# EasyEDA Pro project avaruusantenni_tallylight.eprj, board PCB2
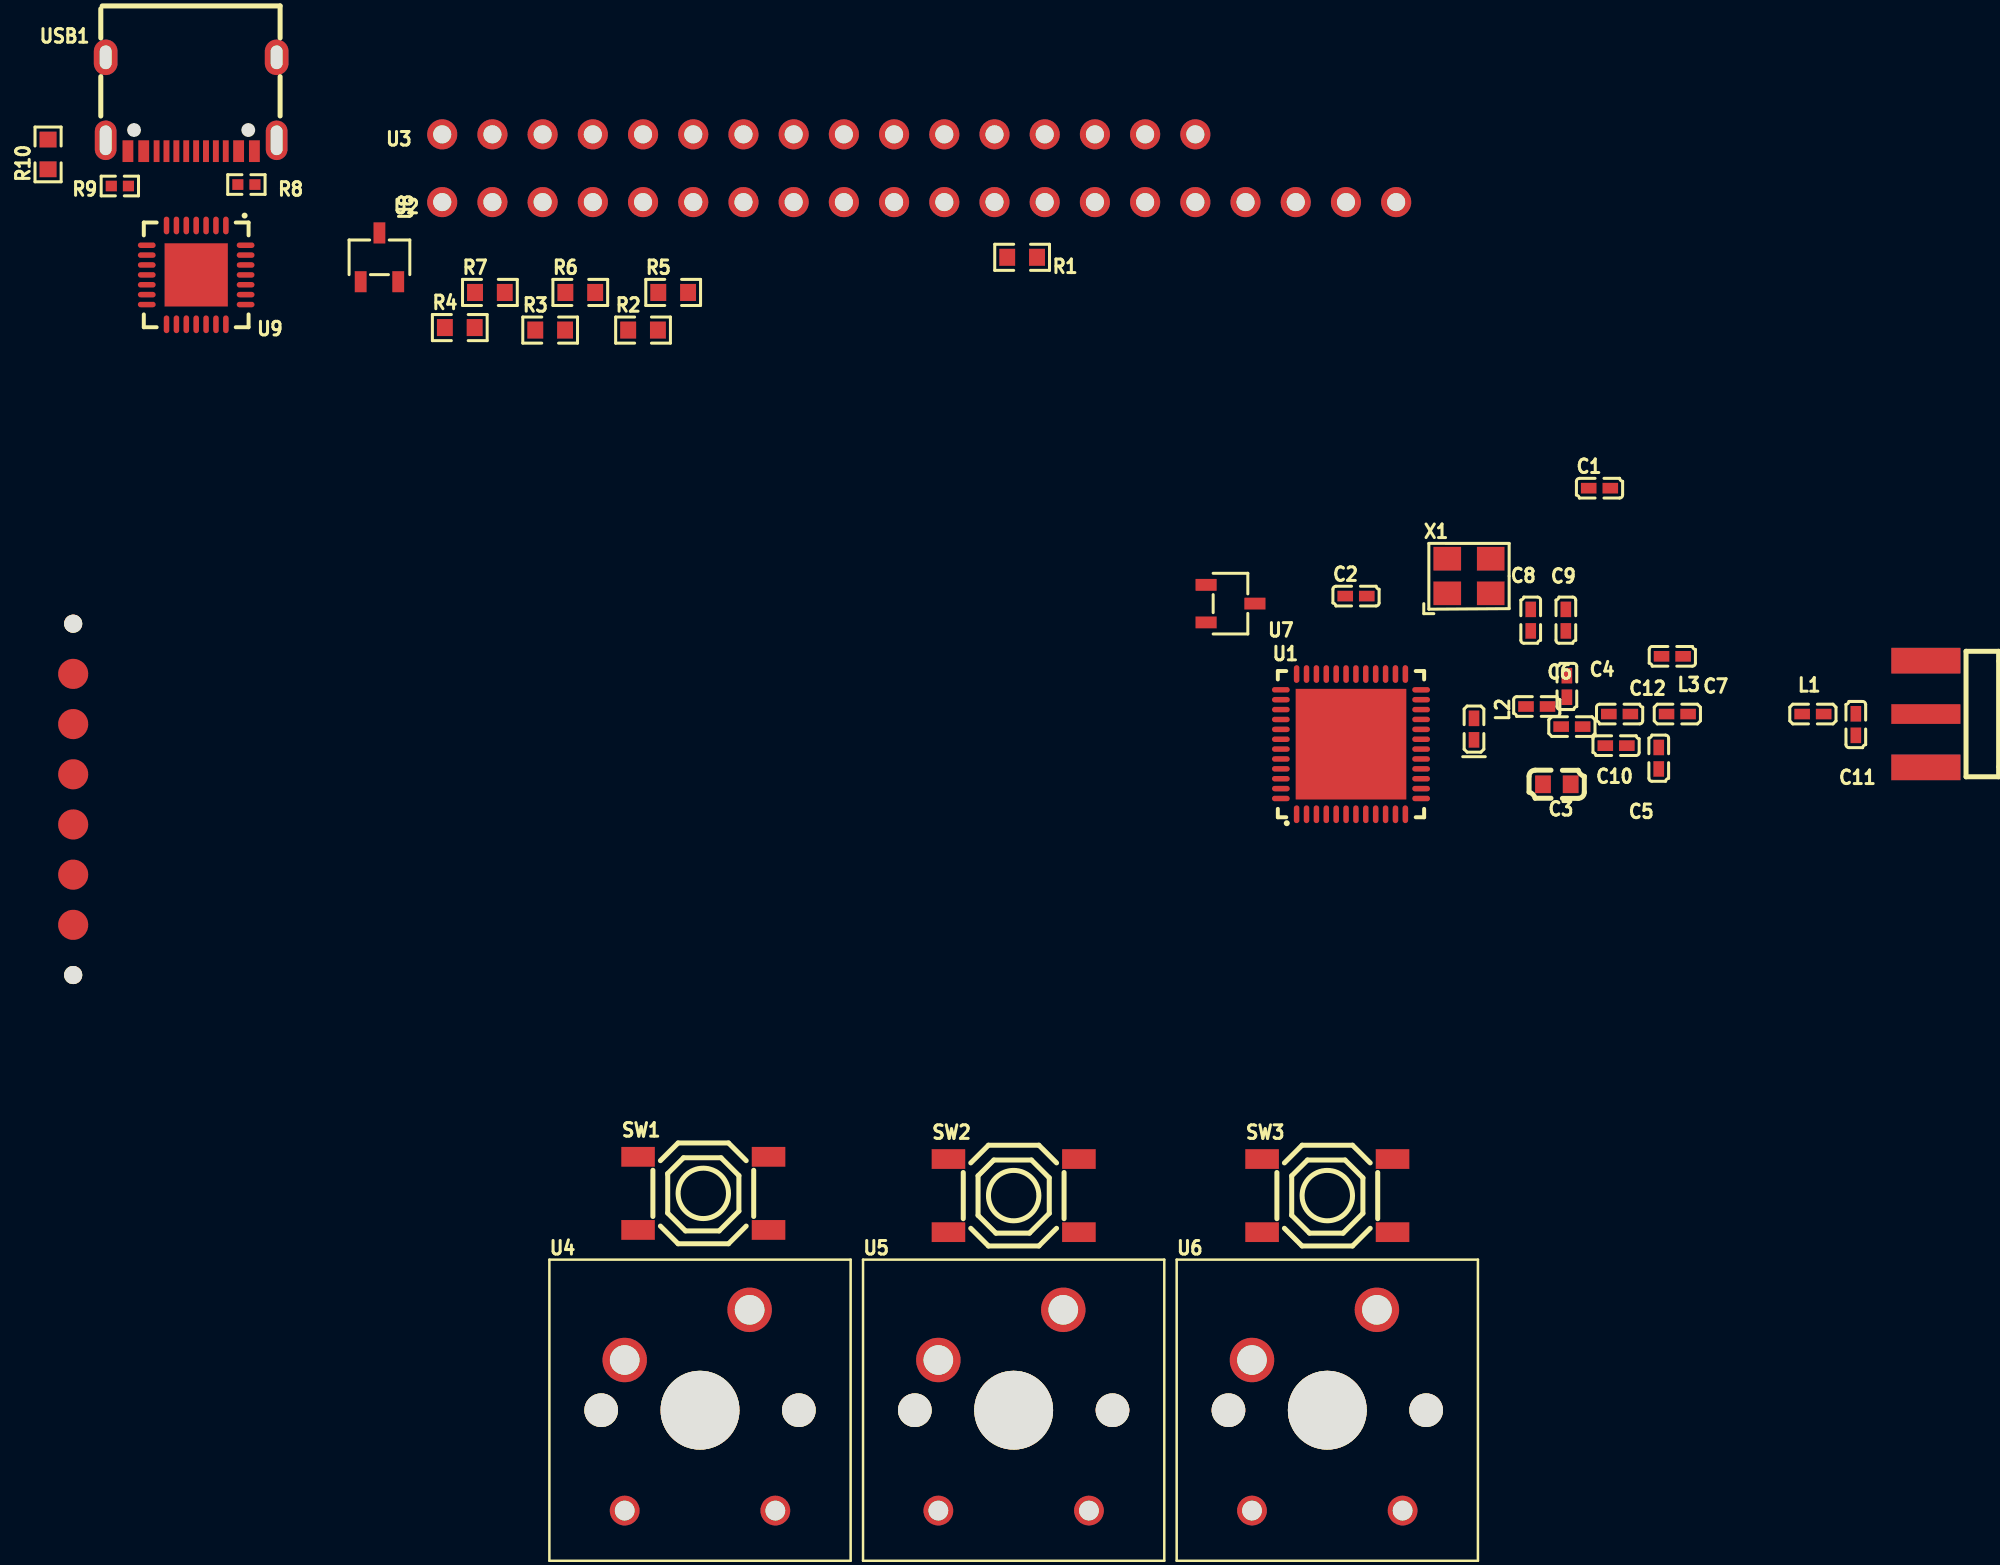
[diagram p10: board, top side]
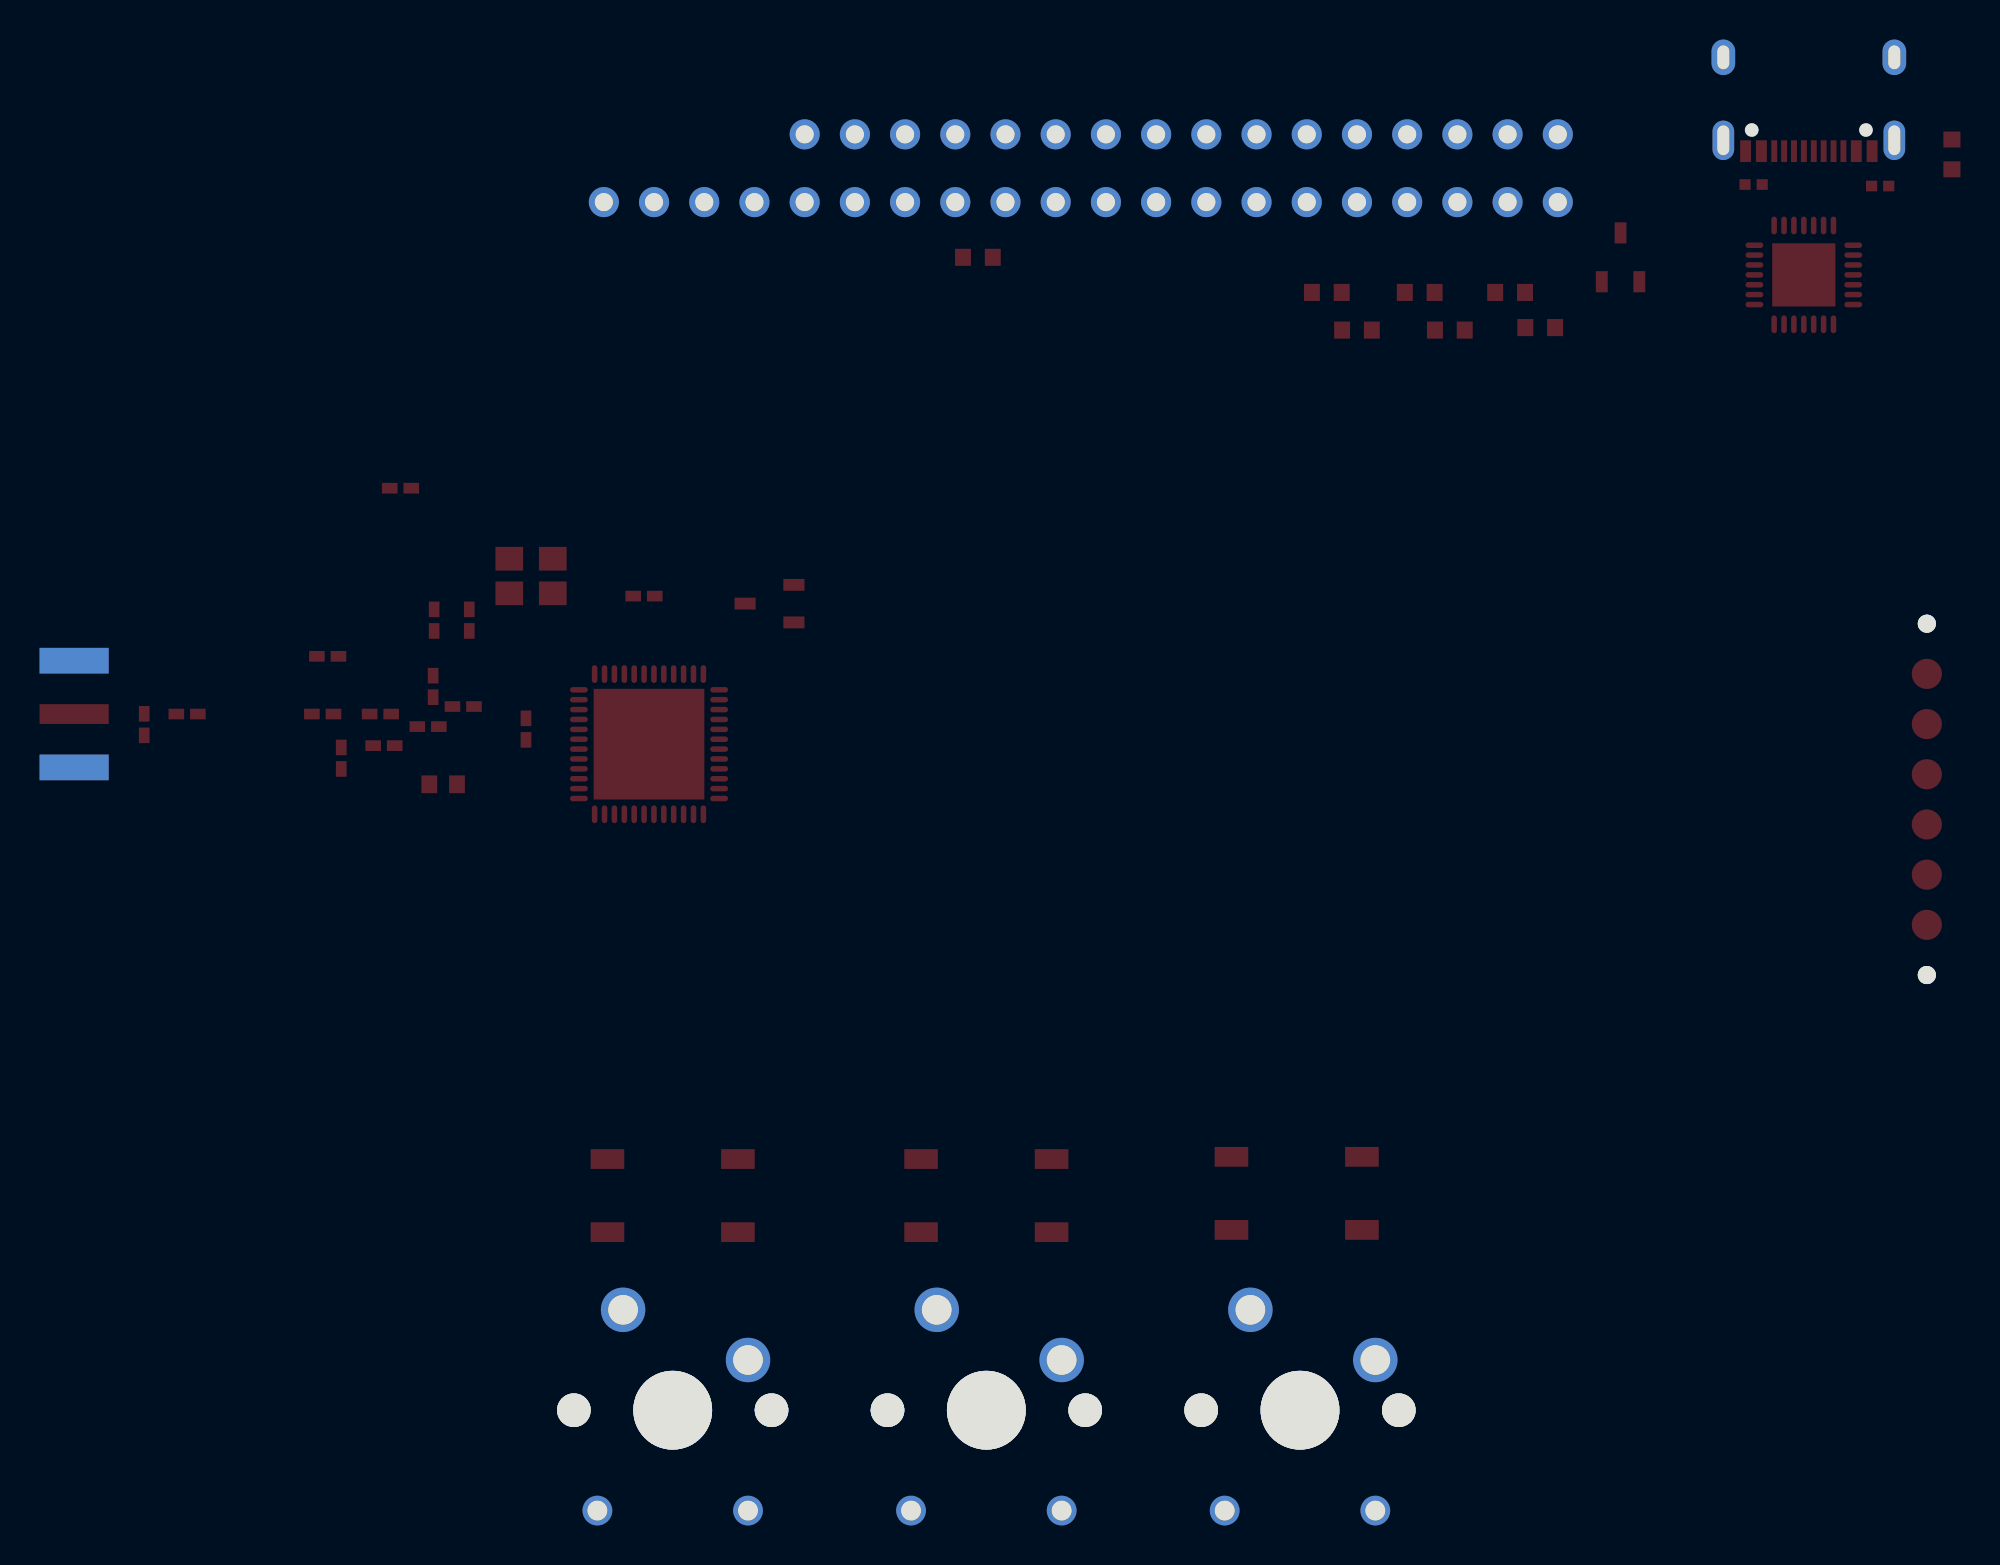
[diagram p11: board, bottom side, seen from below]

Outline 6.47 x 0.69 mm; copper layers: Top Layer, Bottom Layer. Coordinates in mm from the lower left corner of the outline.
Stack: Top Layer 0.035mm / Dielectric1 1.51mm FR4 er 4.5 / Bottom Layer 0.035mm

## Design rules (mm)
template: JLCPCB Capability(Two Layers Board)
spacing copperThickness1oz (default): track to track 0.102, other pairs 0.152 to 0.3
spacing copperThickness2oz: track to track 0.203, other pairs 0.152 to 0.3
track width copperThickness1oz (default): min 0.127, default 0.254, max 2.54
track width copperThickness2oz: min 0.203, default 0.254, max 2.54
differential pair differentialPair (default): width min 0.127, default 0.254, max 2.54; gap min 0.152, default 0.152
via viaSize (default): diameter min 0.5, default 0.61, max 10; hole min 0.3, default 0.305, max 6.3

## Placement (name value [footprint] x y rotation side)
C1  10pF  [C0402]  74.48 -17.78 0 top
C2  10pF  [C0402]  62.17 -23.24 0 top
C3  47nF  [C0603]  72.33 -32.76 0 top
C4  47pF  [C0402]  72.83 -27.81 90 top
C5  2.2pF  [C0402]  77.48 -31.44 90 top
C6  33pF  [C0402]  71.31 -28.83 0 top
C7  33pF  [C0402]  78.17 -26.29 0 top
C8  0.7pF  [C0402]  71 -24.46 270 top
C9  7.5pF  [C0402]  72.78 -24.46 270 top
C10  4.7pF  [C0402]  75.32 -30.81 180 top
C11  2.2pF  [C0402]  87.45 -29.74 90 top
C12  4.7pF  [C0402]  75.5 -29.21 0 top
L1  47nH  [L0402]  85.28 -29.21 0 top
L2  3.3nH  [L0402]  73.09 -29.84 0 top
L3  8.2nH  [L0402]  78.42 -29.21 0 top
L4  9.1nH  [L0402-RD]  68.13 -29.97 90 top
P1  dbg-conn  [AA-DBG-1x6-2.54]  -2.73 -33.53 90 top
R1  0Ω  [R0603]  45.27 -6.09 180 top
R2  0Ω  [R0603]  26.1 -9.78 0 top
R3  0Ω  [R0603]  21.4 -9.78 0 top
R4  0Ω  [R0603]  16.83 -9.65 0 top
R5  0Ω  [R0603]  27.62 -7.87 0 top
R6  0Ω  [R0603]  22.92 -7.87 0 top
R7  0Ω  [R0603]  18.35 -7.87 0 top
R8  5.1kΩ  [R0402]  6.03 -2.41 180 top
R9  5.1kΩ  [R0402]  -0.37 -2.49 0 top
R10  470kΩ  [R0603]  -4 -0.89 90 top
RF1  SMA-KE-P901  [SMA-TH_SMA-KE-P901]  90.99 -29.21 270 top
SW1  TS-1187A-B-A-B  [SW-SMD_4P-L5.1-W5.1-P3.70-LS6.5-TL-2]  29.15 -53.47 0 top
SW2  TS-1187A-B-A-B  [SW-SMD_4P-L5.1-W5.1-P3.70-LS6.5-TL-2]  44.85 -53.58 0 top
SW3  TS-1187A-B-A-B  [SW-SMD_4P-L5.1-W5.1-P3.70-LS6.5-TL-2]  60.71 -53.58 0 top
U1  STM32WLE5CCU6  [UFQFPN-48_L7.0-W7.0-P0.50-BL-EP5.6]  61.91 -30.73 0 top
U2  -  [NewhavenOledModule]  40.07 -3.3 0 top
U3  -  [LCD_1602A]  15.94 0.13 0 top
U4  MX1A-11NN  [CHERRY_MX1A-11NN_SWITCH]  28.98 -64.44 0 top
U5  MX1A-11NN  [CHERRY_MX1A-11NN_SWITCH]  44.85 -64.44 0 top
U6  MX1A-11NN  [CHERRY_MX1A-11NN_SWITCH]  60.71 -64.44 0 top
U7  XC6206P332MR  [SOT-23-3_L2.9-W1.6-P1.90-LS2.8-BR]  55.82 -23.62 180 top
U8  XC6206P332MR  [SOT-23-3_L2.9-W1.6-P1.90-LS2.8-BR]  12.76 -6.09 270 top
U9  CP2102-GMR  [WQFN-28_L5.0-W5.0-P0.50-BL-EP3.2]  3.49 -6.98 180 top
USB1  TYPE-C 16PIN 2MD(073)  [USB-C-SMD_TYPE-C-6PIN-2MD-073]  3.24 1.65 180 top
X1  16MHz  [OSC-SMD_4P-L3.2-W2.5-BL]  67.88 -22.22 0 top

## Footprints (pads in the part's own frame, mm; a bottom-side part is the same pattern mirrored in y, then rotated)
AA-DBG-1x6-2.54
  round 1.524 smd: 1(-6.35,0) 2(-3.81,0) 3(-1.27,0) 4(1.27,0) 5(3.81,0) 6(6.35,0)
  round 0.914 hole 0.914: 7(-8.89,0) 7(8.89,0)
C0402
  rect 0.79x0.54 smd: 1(-0.545,0) 2(0.545,0)
C0603
  rect 0.8x0.9 smd: 1(-0.7,0) 2(0.7,0)
CHERRY_MX1A-11NN_SWITCH
  round 1.508 hole 1: BR1(-3.81,-5.08) BR2(3.81,-5.08)
  round 1.7 hole 1.7: None(-5,0) None(5,0)
  round 3.988 hole 3.988: None(0,0)
  round 2.25 hole 1.5: P$1(2.51,5.08) P$2(-3.81,2.54)
L0402
  rect 0.79x0.54 smd: 1(-0.545,0) 2(0.545,0)
L0402-RD
  rect 0.79x0.54 smd: 1(-0.545,0) 2(0.545,0)
LCD_1602A
  round 1.524 hole 0.914: 1(0,0) 2(2.54,0) 3(5.08,0) 4(7.62,0) 5(10.16,0) 6(12.7,0) 7(15.24,0) 8(17.78,0) 9(20.32,0) 10(22.86,0) 11(25.4,0) 12(27.94,0) 13(30.48,0) 14(33.02,0) 15(35.56,0) 16(38.1,0)
NewhavenOledModule
  round 1.524 hole 0.914: 1(24.13,0) 2(21.59,0) 3(19.05,0) 4(16.51,0) 5(13.97,0) 6(11.43,0) 7(8.89,0) 8(6.35,0) 9(3.81,0) 10(1.27,0) 11(-1.27,0) 12(-3.81,0) 13(-6.35,0) 14(-8.89,0) 15(-11.43,0) 16(-13.97,0) 17(-16.51,0) 18(-19.05,0) 19(-21.59,0) 20(-24.13,0)
OSC-SMD_4P-L3.2-W2.5-BL
  rect 1.4x1.2 smd: 1(-1.1,-0.875) 2(1.1,-0.875) 3(1.1,0.875) 4(-1.1,0.875)
R0402
  rect 0.566x0.54 smd: 1(-0.433,0) 2(0.433,0)
R0603
  rect 0.806x0.864 smd: 1(-0.753,0) 2(0.753,0)
SMA-TH_SMA-KE-P901
  rect 1.3x3.5 smd: 1(-2.7,0) 2(2.7,0)
  rect 1.3x3.5 smd far side: 3(-2.7,0) 4(2.7,0)
  rect 1x3.5 smd: 5(0,0)
SOT-23-3_L2.9-W1.6-P1.90-LS2.8-BR
  rect 1.07x0.6 smd: 1(1.235,-0.95) 2(1.235,0.95) 3(-1.235,0)
SW-SMD_4P-L5.1-W5.1-P3.70-LS6.5-TL-2
  rect 1.7x1 smd: 1(-3.3,1.85) 2(3.3,1.85) 3(-3.3,-1.85) 4(3.3,-1.85)
UFQFPN-48_L7.0-W7.0-P0.50-BL-EP5.6
  oval 0.28x0.9 smd: 1(-2.751,-3.547) 2(-2.251,-3.547) 3(-1.75,-3.547) 4(-1.25,-3.547) 5(-0.75,-3.547) 6(-0.249,-3.547) 7(0.249,-3.547) 8(0.75,-3.547) 9(1.25,-3.547) 10(1.75,-3.547) 11(2.251,-3.547) 12(2.751,-3.547) 25(2.751,3.547) 26(2.251,3.547) 27(1.75,3.547) 28(1.25,3.547) 29(0.75,3.547) 30(0.249,3.547) 31(-0.249,3.547) 32(-0.75,3.547) 33(-1.25,3.547) 34(-1.75,3.547) 35(-2.251,3.547) 36(-2.751,3.547)
  oval 0.9x0.28 smd: 13(3.547,-2.75) 14(3.547,-2.25) 15(3.547,-1.75) 16(3.547,-1.25) 17(3.547,-0.75) 18(3.547,-0.25) 19(3.547,0.25) 20(3.547,0.75) 21(3.547,1.25) 22(3.547,1.75) 23(3.547,2.25) 24(3.547,2.75) 37(-3.547,2.751) 38(-3.547,2.251) 39(-3.547,1.75) 40(-3.547,1.25) 41(-3.547,0.75) 42(-3.547,0.249) 43(-3.547,-0.249) 44(-3.547,-0.75) 45(-3.547,-1.25) 46(-3.547,-1.75) 47(-3.547,-2.251) 48(-3.547,-2.751)
  rect 5.6x5.6 smd: 49(0,0)
USB-C-SMD_TYPE-C-6PIN-2MD-073
  rect 0.55x1.1 smd: 1(-3.2,2.375) 2(-2.4,2.375) 11(2.4,2.375) 12(3.2,2.375)
  rect 0.3x1.1 smd: 3(-1.75,2.375) 4(-1.25,2.375) 5(-0.75,2.375) 6(-0.25,2.375) 7(0.25,2.375) 8(0.75,2.375) 9(1.25,2.375) 10(1.75,2.375)
  oval 1.1x2 hole 0.6x1.5: 13(-4.325,1.825) 14(4.325,1.825)
  oval 1.2x1.8 hole 0.6x1.2: 13(-4.325,-2.375) 14(4.325,-2.375)
WQFN-28_L5.0-W5.0-P0.50-BL-EP3.2
  oval 0.28x0.9 smd: 1(-1.502,-2.5) 2(-1.001,-2.5) 3(-0.5,-2.5) 4(0,-2.5) 5(0.5,-2.5) 6(1,-2.5) 7(1.501,-2.5) 15(1.501,2.5) 16(1,2.5) 17(0.5,2.5) 18(0,2.5) 19(-0.5,2.5) 20(-1.001,2.5) 21(-1.502,2.5)
  oval 0.9x0.28 smd: 8(2.5,-1.502) 9(2.5,-1.001) 10(2.5,-0.5) 11(2.5,0) 12(2.5,0.5) 13(2.5,1) 14(2.5,1.501) 22(-2.5,1.501) 23(-2.5,1) 24(-2.5,0.5) 25(-2.5,0) 26(-2.5,-0.5) 27(-2.5,-1.001) 28(-2.5,-1.502)
  rect 3.2x3.2 smd: 29(0,0)

## Nets
3V3: P1.6 U7.2
3V3_2: R2.1 R3.1 R4.1 U2.2 U8.2
+5V: U3.2 U3.3 U3.15 U7.3 U8.3 U9.7 U9.8 USB1.2 USB1.11
GND: C1.1 C2.2 C3.1 C4.1 C8.1 C9.1 C11.1 C12.1 P1.5 R5.2 R6.2 R7.2 R8.1 R9.1 R10.1 RF1.1 RF1.2 RF1.3 RF1.4 U1.48 U1.49 U2.1 U2.3 U2.20 U3.1 U3.16 U7.1 U8.1 U9.3 USB1.1 USB1.12 X1.2 X1.4
1: U1.31 U2.4
2: U1.32 U2.5
3: U1.33 U2.6 U3.14
6: R1.2 U1.38 U2.9 U3.11
7: U1.39 U2.10 U3.10
8: U1.40 U2.11 U3.9
9: U1.43 U2.12 U3.8
10: U1.1 U2.13 U3.7
11: U1.2 U2.14 U3.6
12: U1.3 U2.15 U3.5
13: U1.4 U2.16 U3.4
BS0: R2.2 R5.1 U2.17
BS1: R3.2 R6.1 U2.18
BS2: R4.2 R7.1 U2.19
D+: U9.4 USB1.6 USB1.8
D-: U9.5 USB1.5 USB1.7
MCU_RX: U1.10 U9.26
MCU_RX_DBG: P1.1
MCU_TX: U1.9 U9.25
MCU_TX_DBG: P1.2
OSC_IN: C2.1 U1.26 X1.3
OSC_OUT: C1.2 U1.27 X1.1
RFI_N: C10.2 L4.2 U1.21
RFI_P: C12.2 L4.1 U1.20
RFO_HP: C6.1 L1.1 U1.23
SCL: U1.35 U2.7 U3.13
SDA: R1.1 U1.34 U2.8 U3.12
SWCLK: P1.3 U1.42
SWDIO: P1.4 U1.36
VR_PA: C3.2 C4.2 L1.2 U1.24
$3N555: R9.2 USB1.10
$3N562: R8.2 USB1.4
$3N1134: R10.2 USB1.13 USB1.14
$4I2621/$1N692: C5.1 C6.2 C8.2 C10.1 L2.1
$4I2621/$1N693: C5.2 C9.2 L2.2 L3.1
$4I2621/$1N694: C7.1 L3.2
$4N2202: C7.2 C11.2 RF1.5

Pads without a net: P1 7; SW1 1 2 3 4; SW2 1 2 3 4; SW3 1 2 3 4; U1 5 6 7 8 11 12 13 14 15 16 17 18 19 22 25 28 29 30 37 41 44 45 46 47; U4 BR1 BR2 None P$1 P$2; U5 BR1 BR2 None P$1 P$2; U6 BR1 BR2 None P$1 P$2; U9 1 2 6 9 10 11 12 13 14 15 16 17 18 19 20 21 22 23 24 27 28 29; USB1 3 9
